# Altium project Calcul8.PrjPcb
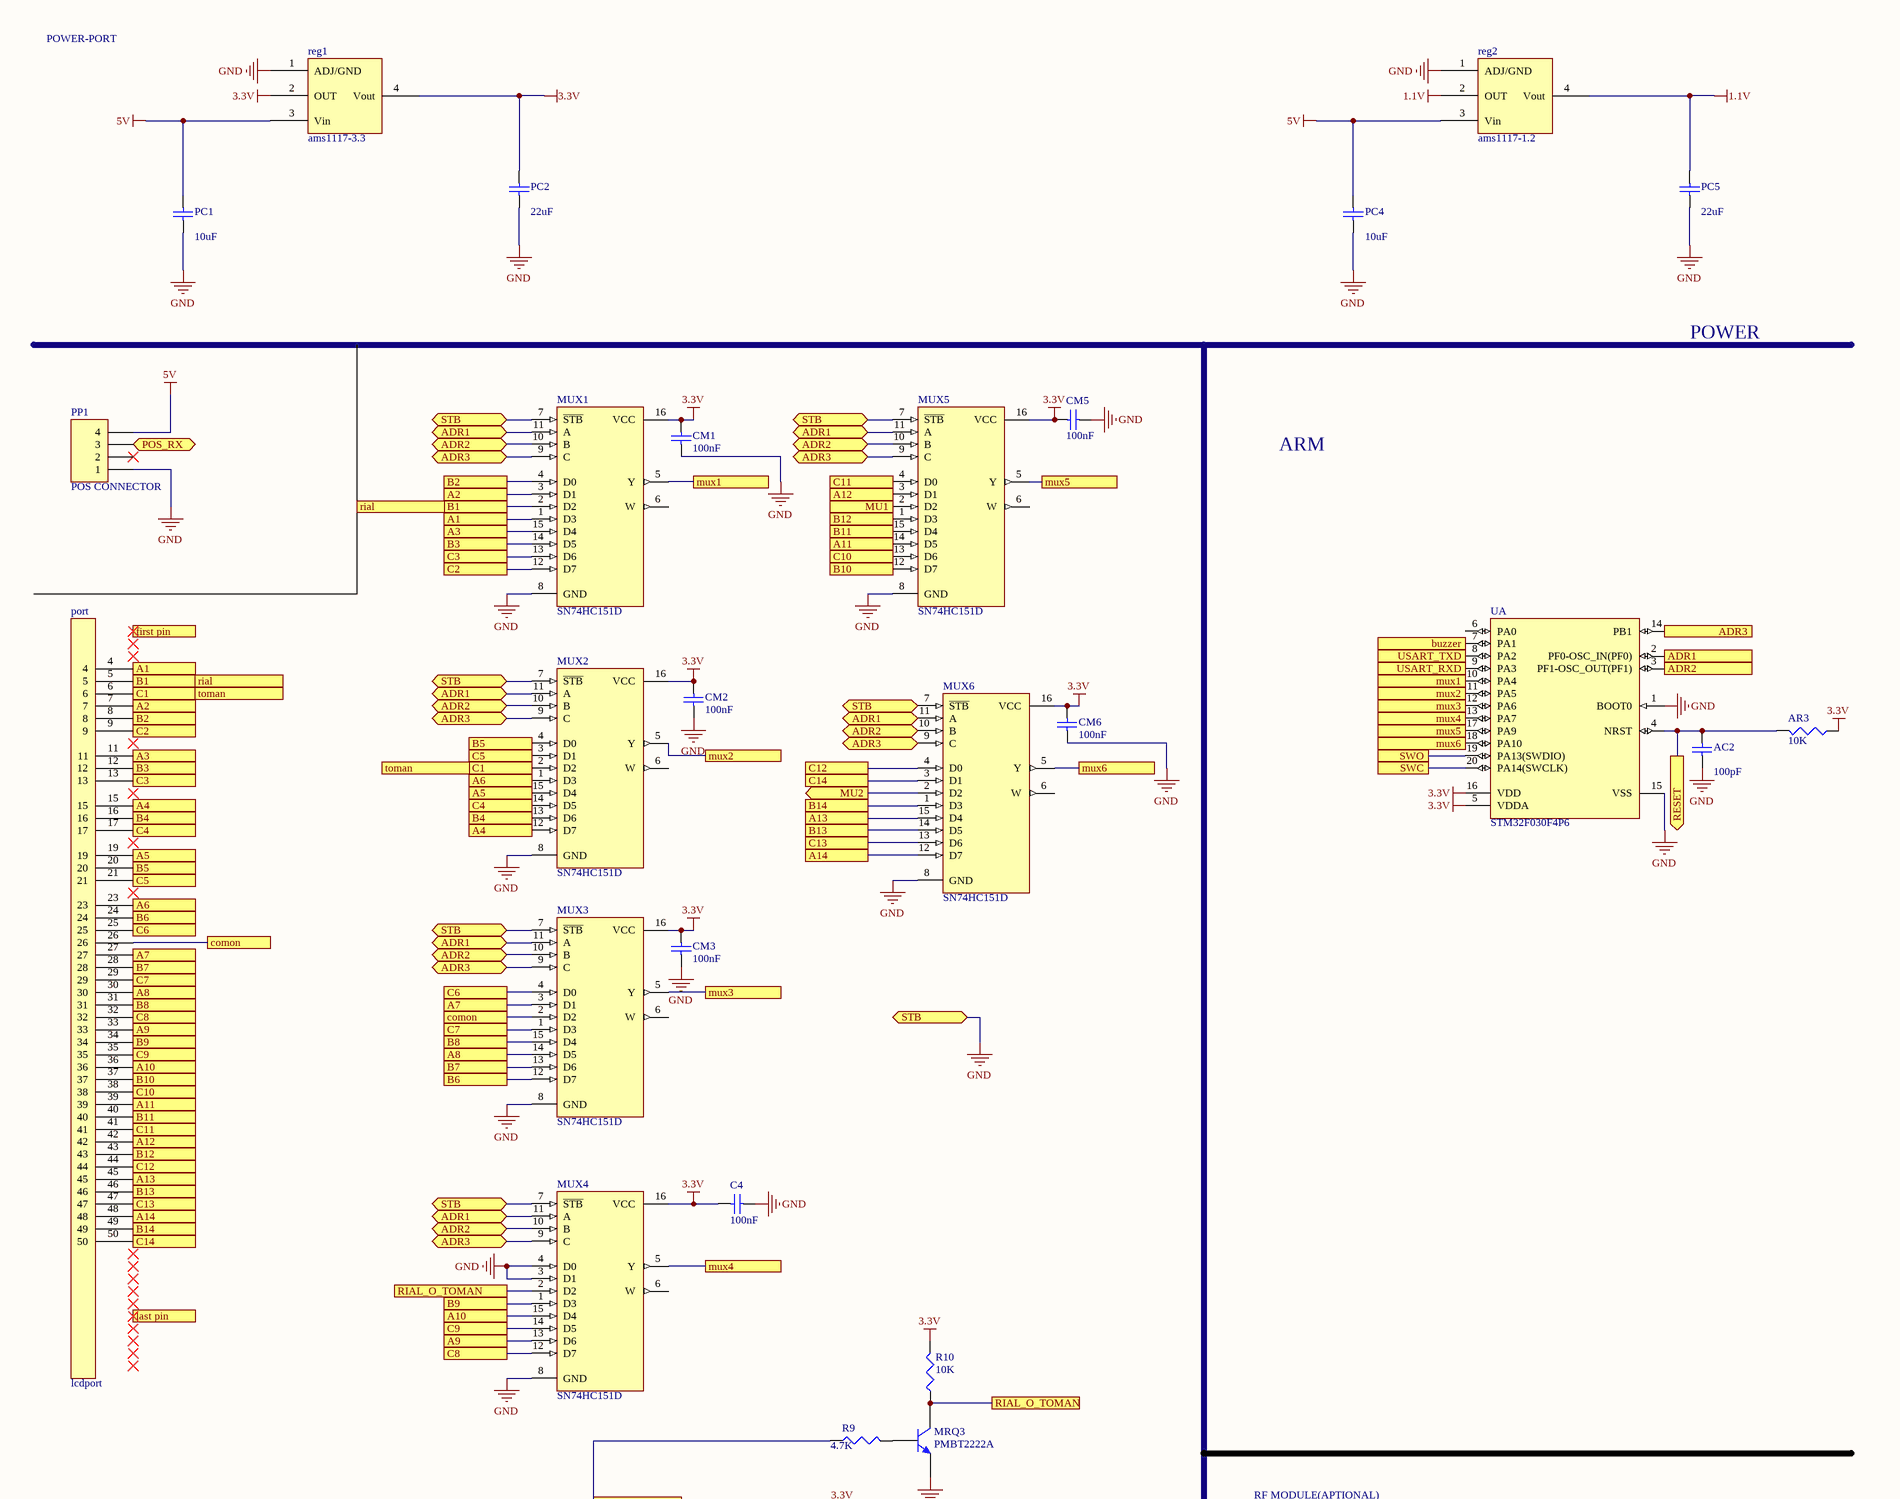
[diagram p0: Calcul8_SCH.SchDoc, top]
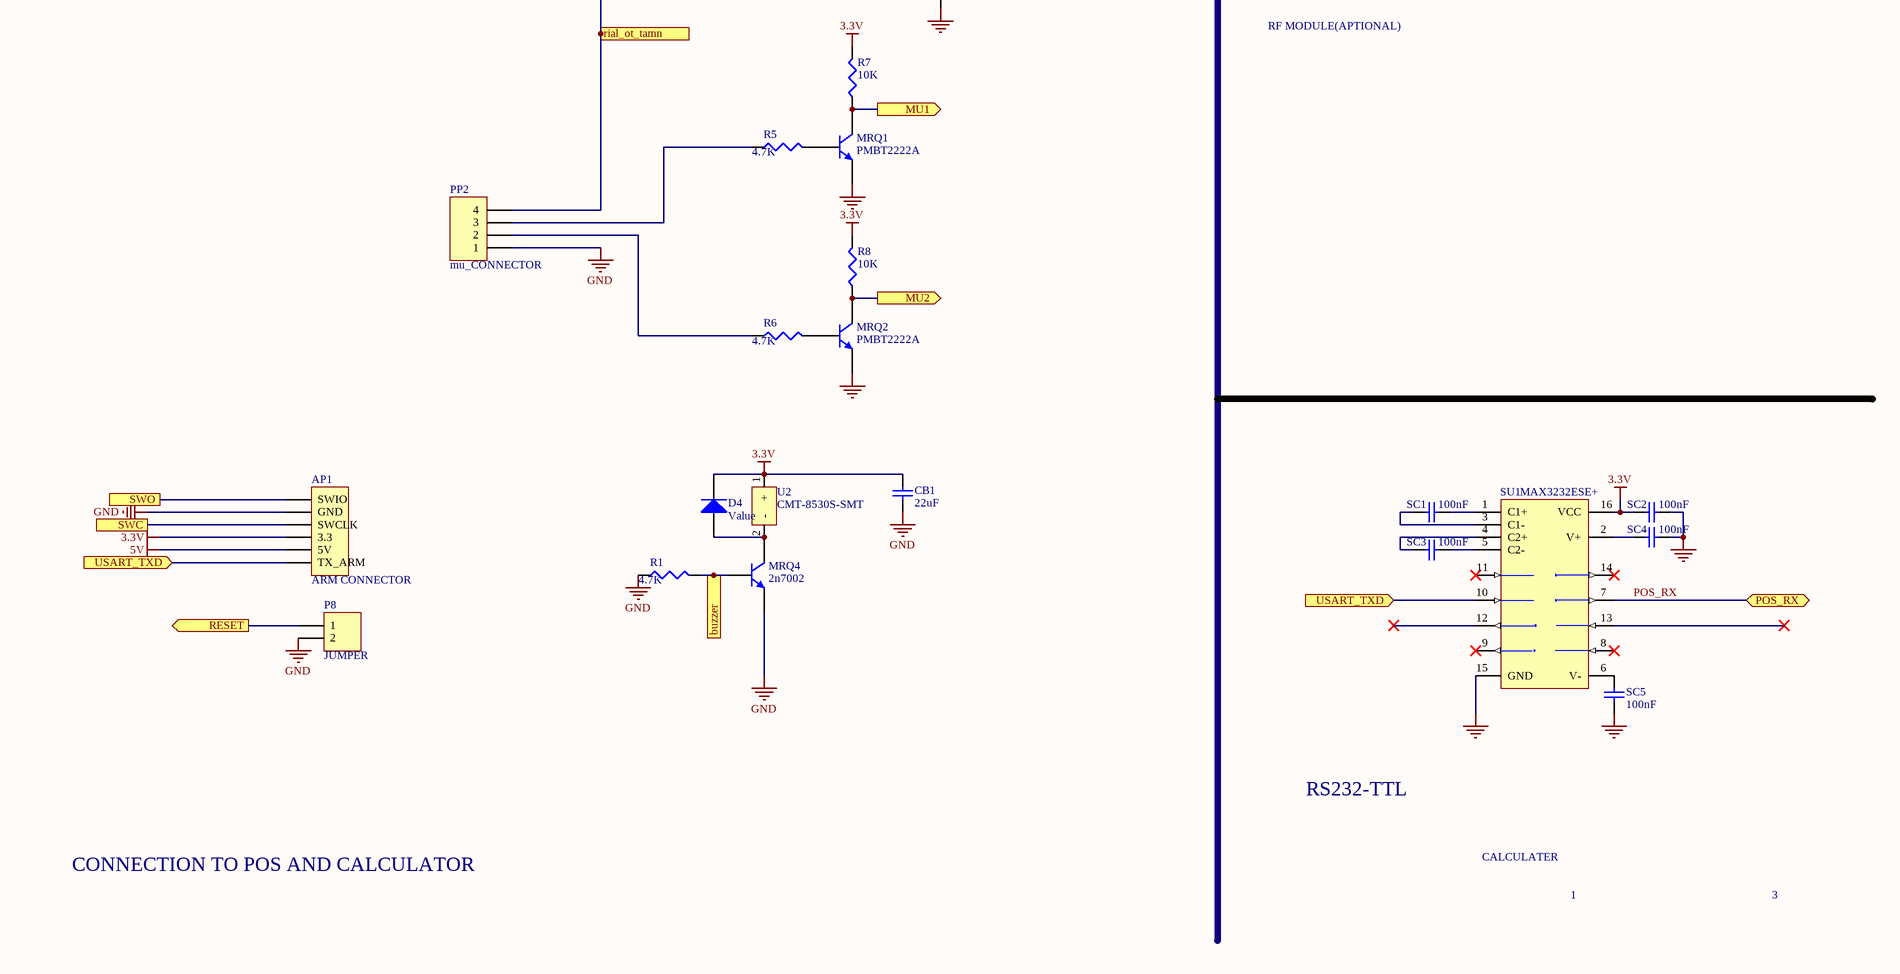
[diagram p1: Calcul8_SCH.SchDoc, bottom]
1 sheet, 46 parts. Net scope: flat (ports and power ports of the same name join across sheets).
Board file: Calcul8_PCB.PcbDoc

## Sheet Calcul8_SCH.SchDoc
size 381 x 495 mm; DocumentNumber: 1; Revision: J; CurrentTime: 30/3/97; DocumentName: CALCULATOR

### Parts
AC2  value 100pF  [1608[0603]]  (hidden comment: Cap Semi)
AP1  ARM CONNECTOR  [HDR1X6]
AR3  value 10K  [J1-0603]  (hidden comment: Res3)
C4  100nF  [1608[0603]]
CB1  value 22uF  [C1206]  (hidden comment: Cap Semi)
CM1  100nF  [1608[0603]]
CM2  100nF  [1608[0603]]
CM3  100nF  [1608[0603]]
CM5  100nF  [1608[0603]]
CM6  100nF  [1608[0603]]
D4  Value  [SOD-80]
MRQ1  PMBT2222A  [SOT-23_M]
MRQ2  PMBT2222A  [SOT-23_M]
MRQ3  PMBT2222A  [SOT-23_M]
MRQ4  2n7002  [SOT-23_M]
MUX1  SN74HC151D  [mux]
MUX2  SN74HC151D  [mux]
MUX3  SN74HC151D  [mux]
MUX4  SN74HC151D  [mux]
MUX5  SN74HC151D  [mux]
MUX6  SN74HC151D  [mux]
P8  JUMPER  [HDR1X2]
PC1  value 10uF  [C1206]  (hidden comment: PC1)
PC2  value 22uF  [C1206]  (hidden comment: Cap Semi)
PC4  value 10uF  [C1206]  (hidden comment: PC1)
PC5  value 22uF  [C1206]  (hidden comment: Cap Semi)
port  lcdport  [lcd_pad_2]
PP1  POS CONNECTOR  [HDR1X4]
PP2  mu_CONNECTOR  [HDR1X4]
R1  value 4.7K  [1608[0603]]  (hidden comment: Res3)
R5  value 4.7K  [1608[0603]]  (hidden comment: Res3)
R6  value 4.7K  [1608[0603]]  (hidden comment: Res3)
R7  value 10K  [1608[0603]]  (hidden comment: Res3)
R8  value 10K  [1608[0603]]  (hidden comment: Res3)
R9  value 4.7K  [1608[0603]]  (hidden comment: Res3)
R10  value 10K  [1608[0603]]  (hidden comment: Res3)
reg1  ams1117-3.3  [ams]
reg2  ams1117-1.2  [ams]
SC1  100nF  [1608[0603]]
SC2  100nF  [1608[0603]]
SC3  100nF  [1608[0603]]
SC4  100nF  [1608[0603]]
SC5  100nF  [1608[0603]]
SU1  MAX3232ESE+  [SO16_N]
U2  CMT-8530S-SMT  [CMT-8530S-SMT]
UA  STM32F030F4P6  [STM-TSSOP20_L]

### Ports
A1, A2, A3, A4, A5, A6, A7, A8, A9, A10, A11, A12, A13, A14, ADR1, ADR1 (bidir), ADR2, ADR2 (bidir), ADR3, ADR3 (bidir), B1, B2, B3, B4, B5, B6, B7, B8, B9, B10, B11, B12, B13, B14, buzzer, C1, C2, C3, C4, C5, C6, C7, C8, C9, C10, C11, C12, C13, C14, comon, first pin, last pin, MU1 (out), MU2 (out), mux1, mux2, mux3, mux4, mux5, mux6, POS_RX (bidir), RESET (out), rial, RIAL_O_TOMAN, rial_ot_tamn, STB (bidir), SWC, SWO, toman, USART_RXD (in), USART_TXD (in)

### Nets
1.1V: PC5.1 reg2.2(OUT) reg2.4(Vout)
3.3V: AP1.4(3.3) AR3.1 C4.2 CB1.1 CM1.2 CM2.2 CM3.1 CM5.2 CM6.2 D4.2(K) MUX1.16(VCC) MUX2.16(VCC) MUX3.16(VCC) MUX4.16(VCC) MUX5.16(VCC) MUX6.16(VCC) PC2.1 R7.2 R8.2 R10.2 reg1.2(OUT) reg1.4(Vout) SC2.2 SU1.16(VCC) U2.1(+) UA.5(VDDA) UA.16(VDD)
5V: AP1.5(5V) PC1.1 PC4.1 PP1.4 reg1.3(Vin) reg2.3(Vin)
GND: AC2.2 AP1.2(GND) C4.1 CB1.2 CM1.1 CM2.1 CM3.2 CM5.1 CM6.1 MRQ1.2(E) MRQ2.2(E) MRQ3.2(E) MRQ4.2(E) MUX1.7(~{STB}) MUX1.8(GND) MUX2.7(~{STB}) MUX2.8(GND) MUX3.7(~{STB}) MUX3.8(GND) MUX4.3(D1) MUX4.4(D0) MUX4.7(~{STB}) MUX4.8(GND) MUX5.7(~{STB}) MUX5.8(GND) MUX6.7(~{STB}) MUX6.8(GND) P8.2 PC1.2 PC2.2 PC4.2 PC5.2 PP1.1 PP2.1 R1.1 reg1.1(ADJ/GND) reg2.1(ADJ/GND) SC2.1 SC4.2 SC5.1 SU1.15(GND) UA.1(BOOT0) UA.15(VSS) ; port STB
POS_RX: PP1.3 SU1.7(T2OUT) ; port POS_RX
NetAC2_1: AC2.1 AR3.2 P8.1 UA.4(NRST) ; port RESET
NetAP1_1: AP1.1(SWIO) UA.19(PA13(SWDIO)) ; port SWO
NetAP1_3: AP1.3(SWCLK) UA.20(PA14(SWCLK)) ; port SWC
NetAP1_6: AP1.6(TX_ARM) SU1.10(T2IN) UA.8(PA2) ; port USART_TXD
NetD4_1: D4.1(A) MRQ4.3(C) U2.2(-)
NetMRQ1_1: MRQ1.1(B) R5.2
NetMRQ1_3: MRQ1.3(C) MUX5.2(D2) R7.1 ; port MU1
NetMRQ2_1: MRQ2.1(B) R6.2
NetMRQ2_3: MRQ2.3(C) MUX6.2(D2) R8.1 ; port MU2
NetMRQ3_1: MRQ3.1(B) R9.2
NetMRQ3_3: MRQ3.3(C) MUX4.2(D2) R10.1 ; port RIAL_O_TOMAN
NetMRQ4_1: MRQ4.1(B) R1.2 UA.7(PA1) ; port buzzer
NetMUX1_1: MUX1.1(D3) port.4 ; port A1
NetMUX1_2: MUX1.2(D2) port.5 ; port B1, port rial
NetMUX1_3: MUX1.3(D1) port.7 ; port A2
NetMUX1_4: MUX1.4(D0) port.8 ; port B2
NetMUX1_5: MUX1.5(Y) UA.10(PA4) ; port mux1
NetMUX1_9: MUX1.9(C) MUX2.9(C) MUX3.9(C) MUX4.9(C) MUX5.9(C) MUX6.9(C) UA.14(PB1) ; port ADR3
NetMUX1_10: MUX1.10(B) MUX2.10(B) MUX3.10(B) MUX4.10(B) MUX5.10(B) MUX6.10(B) UA.3(PF1-OSC_OUT(PF1)) ; port ADR2
NetMUX1_11: MUX1.11(A) MUX2.11(A) MUX3.11(A) MUX4.11(A) MUX5.11(A) MUX6.11(A) UA.2(PF0-OSC_IN(PF0)) ; port ADR1
NetMUX1_12: MUX1.12(D7) port.9 ; port C2
NetMUX1_13: MUX1.13(D6) port.13 ; port C3
NetMUX1_14: MUX1.14(D5) port.12 ; port B3
NetMUX1_15: MUX1.15(D4) port.11 ; port A3
NetMUX2_1: MUX2.1(D3) port.23 ; port A6
NetMUX2_2: MUX2.2(D2) port.6 ; port C1, port toman
NetMUX2_3: MUX2.3(D1) port.21 ; port C5
NetMUX2_4: MUX2.4(D0) port.20 ; port B5
NetMUX2_5: MUX2.5(Y) UA.11(PA5) ; port mux2
NetMUX2_12: MUX2.12(D7) port.15 ; port A4
NetMUX2_13: MUX2.13(D6) port.16 ; port B4
NetMUX2_14: MUX2.14(D5) port.17 ; port C4
NetMUX2_15: MUX2.15(D4) port.19 ; port A5
NetMUX3_1: MUX3.1(D3) port.29 ; port C7
NetMUX3_2: MUX3.2(D2) port.26 ; port comon
NetMUX3_3: MUX3.3(D1) port.27 ; port A7
NetMUX3_4: MUX3.4(D0) port.25 ; port C6
NetMUX3_5: MUX3.5(Y) UA.12(PA6) ; port mux3
NetMUX3_12: MUX3.12(D7) port.24 ; port B6
NetMUX3_13: MUX3.13(D6) port.28 ; port B7
NetMUX3_14: MUX3.14(D5) port.30 ; port A8
NetMUX3_15: MUX3.15(D4) port.31 ; port B8
NetMUX4_1: MUX4.1(D3) port.34 ; port B9
NetMUX4_5: MUX4.5(Y) UA.13(PA7) ; port mux4
NetMUX4_12: MUX4.12(D7) port.32 ; port C8
NetMUX4_13: MUX4.13(D6) port.33 ; port A9
NetMUX4_14: MUX4.14(D5) port.35 ; port C9
NetMUX4_15: MUX4.15(D4) port.36 ; port A10
NetMUX5_1: MUX5.1(D3) port.43 ; port B12
NetMUX5_3: MUX5.3(D1) port.42 ; port A12
NetMUX5_4: MUX5.4(D0) port.41 ; port C11
NetMUX5_5: MUX5.5(Y) UA.17(PA9) ; port mux5
NetMUX5_12: MUX5.12(D7) port.37 ; port B10
NetMUX5_13: MUX5.13(D6) port.38 ; port C10
NetMUX5_14: MUX5.14(D5) port.39 ; port A11
NetMUX5_15: MUX5.15(D4) port.40 ; port B11
NetMUX6_1: MUX6.1(D3) port.49 ; port B14
NetMUX6_3: MUX6.3(D1) port.50 ; port C14
NetMUX6_4: MUX6.4(D0) port.44 ; port C12
NetMUX6_5: MUX6.5(Y) UA.18(PA10) ; port mux6
NetMUX6_12: MUX6.12(D7) port.48 ; port A14
NetMUX6_13: MUX6.13(D6) port.47 ; port C13
NetMUX6_14: MUX6.14(D5) port.46 ; port B13
NetMUX6_15: MUX6.15(D4) port.45 ; port A13
NetPP2_2: PP2.2 R6.1
NetPP2_3: PP2.3 R5.1
NetPP2_4: PP2.4 R9.1 ; port rial_ot_tamn
NetSC1_1: SC1.1 SU1.3(C1-)
NetSC1_2: SC1.2 SU1.1(C1+)
NetSC3_1: SC3.1 SU1.4(C2+)
NetSC3_2: SC3.2 SU1.5(C2-)
NetSC4_1: SC4.1 SU1.2(V+)
NetSC5_2: SC5.2 SU1.6(V-)
NetUA_9: UA.9(PA3) ; port USART_RXD

Not connected (* = marked no-connect by the designer): MUX1 6(W); MUX2 6(W); MUX3 6(W); MUX4 6(W); MUX5 6(W); MUX6 6(W); PP1 2*; SU1 8(R2IN)* 9(R2OUT)* 11(T1IN)* 12(R1OUT)* 13(R1IN)* 14(T1OUT)*; UA 6(PA0)

### Notes on the sheet
- POWER-PORT
- POWER
- ARM
- RF MODULE(APTIONAL)
- RS232-TTL
- CALCULATER
- CONNECTION TO POS AND CALCULATOR
- 1
- 3

### Library data of the parts
AC2 CB1 PC1 PC2 PC4 PC5 = Cap Semi: Capacitor (Semiconductor SIM Model); Published: 8-Jun-2000; LatestRevisionDate: 29-May-2009; LatestRevisionNote: IPC-7351 Footprint Added.; PackageReference: C1206; Publisher: Altium Limited; PackageDescription: Chip Capacitor
AP1 = Header 6: Header, 6-Pin; LatestRevisionDate: 17-Jul-2002; LatestRevisionNote: Re-released for DXP Platform.; Publisher: Altium Limited
AR3 R1 R5-R10 = Res3: Resistor; Published: 8-Jun-2000; LatestRevisionDate: 29-May-2009; LatestRevisionNote: IPC-7351 Footprint Added.; PackageReference: J1-0603; Publisher: Altium Limited; PackageDescription: Chip Resistor
C4 CM1-CM3 CM5 CM6 SC1-SC5 = Cap Semi: Capacitor; Tolerance: 10%; Dielectric: X7R; Company: AVX; Foreign Supplyer: False; Value: 100nF; Category: Capacitor; Subcategory: Ceramic; Package: 0603; Part Number: *; Voltage: *; Power: *
D4 = Diode: Default Diode; Published: 8-Jun-2000; LatestRevisionDate: 17-Jul-2002; LatestRevisionNote: Re-released for DXP Platform.; PackageVersion: Sep-1996; PackageReference: SMC; Publisher: Altium Limited; PackageDescription: DO-214-AB/SMC; 2 C-Bend Leads; Body 7.9 x 5.9 mm, inc. leads (LxW); Code_JEDEC: DO-214-AB
MRQ1-MRQ4 = NPN: NPN Bipolar Transistor; Published: 8-Jun-2000; LatestRevisionDate: 17-Jul-2002; LatestRevisionNote: Re-released for DXP Platform.; PackageReference: TO-226-AA; Publisher: Altium Limited; PackageDescription: TO, Flat Index; 3 In-Line, Axial Leads; Body Dia. 4.8mm; Leads 0.55 x 0.51 mm (max); Code_JEDEC: TO-226-AA
MUX1-MUX6 = SN74HC151D: 8-Line to 1-Line Data Selector/Multiplexer; Published: 8-Jun-2000; LatestRevisionDate: 13-Apr-2006; LatestRevisionNote: IPC-7351 Footprint Added.; DatasheetVersion: May-1997; PackageVersion: Jan-1998; PackageReference: D016; Publisher: Altium Limited; PackageDescription: 16-Pin Small Outline Integrated Circuit 1.27 mm Pitch; Code_IPC: SOIC127P600-16; ComponentLink1Description: Manufacturer Link; ComponentLink1URL: http://www.ti.com/; ComponentLink2Description: Datasheet; ComponentLink2URL: http://www-s.ti.com/sc/ds/sn74hc151.pdf
P8 = Header 2: Header, 2-Pin; LatestRevisionDate: 17-Jul-2002; LatestRevisionNote: Re-released for DXP Platform.; Publisher: Altium Limited
port = lcdport: pl
PP1 PP2 = Header 4: Header, 4-Pin; LatestRevisionDate: 17-Jul-2002; LatestRevisionNote: Re-released for DXP Platform.; Publisher: Altium Limited
reg2 = ams1117-3.3
SU1 = MAX3232CSE: 3.0V TO 5.5V, Low-Power, up to 1Mbps, True RS-232 Transceiver Using Four 0.1µF External Capacitor; Company: MAXIM; Foreign Supplyer: False; Category: IC; Subcategory: MAX; Dielectric: *; Package: SO16; Part Number: MAX3232ESE+; Power.: *; Tolerance: *; Value: MAX3232ESE+; Voltage: *
UA = STM32F030F4P6: ARM Cortex-M0 32-bit MCU, 16 KB Flash, 4 KB Internal RAM, 15 I/Os, 20-pin TSSOP, -40 to 85 degC, Tube; FLASH Size (Prog) (kB): 16; I/Os (High Current): 15; Internal RAM Size (kB): 4; Operating Frequency(F) (Processor speed) (MHz): 48; Supply Voltage(Vcc) min (V): 2.4; DatasheetVersion: Rev. 1; PackageVersion: Rev. 1, 11/2012; PackageReference: TSSOP20; PackageDescription: 20-Pin Thin Shrink Small Outline Package, 6.5 x 4.4 mm Body, 0.65 mm Pitch; Supplier 1: Digi-Key; Supplier Part Number 1: 497-14044-5-ND; Supplier 2: Newark; Supplier Part Number 2: 06X3648; Supplier 3: Mouser; Supplier Part Number 3: 511-STM32F030F4P6; Core: ARM Cortex-M0; Packing: Tube; Mounting Technology: Surface Mount; PartNumber: STM32F030F4P6; ComponentLink1Description: Manufacturer URL; ComponentLink1URL: http://www.st.com/web/en/home.html; ComponentLink2Description: Datasheet; ComponentLink2URL: http://www.st.com/st-web-ui/static/active/en/resource/technical/document/datasheet/DM00088500.pdf; ComponentLink3Description: Package Specification; ComponentLink3URL: http://www.st.com/st-web-ui/static/active/en/resource/technical/document/datasheet/DM00065136.pdf